# EAGLE schematic Control board (EAGLE 7.2.0)
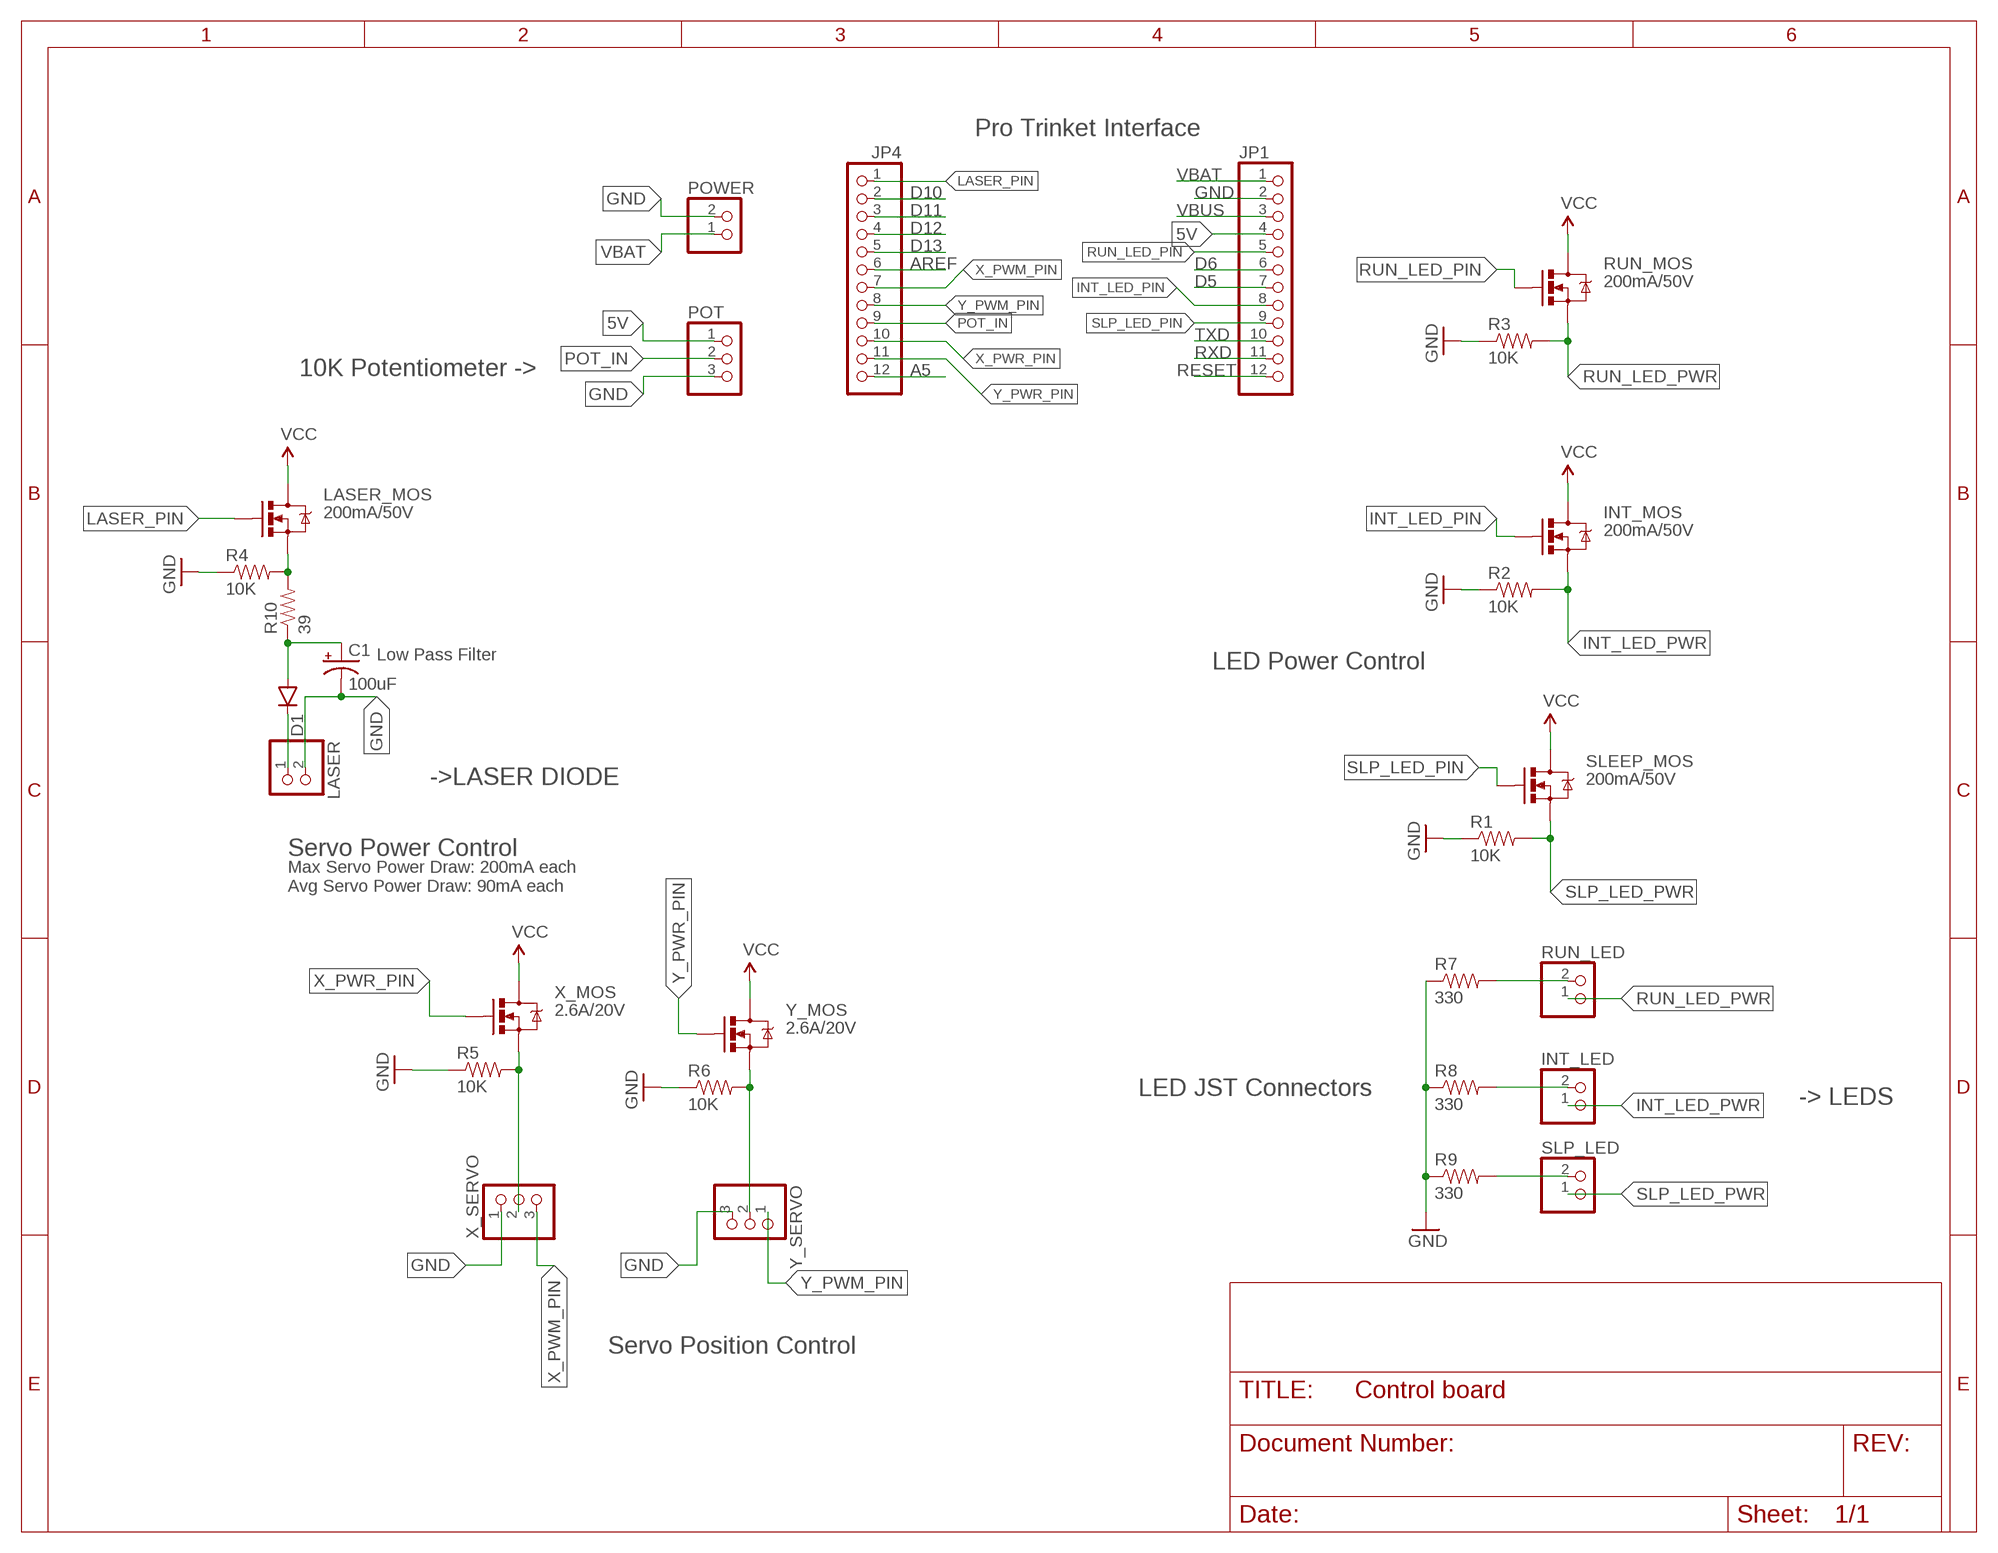
[diagram p0: schematic, sheet 1]

## Parts
C1  100uF  100UF-10V-10%(TANT)  [EIA7343]
D1  DIODESOD123  [SOD-123]
INT_LED  JST_2PIN-SMT-RA  [JST-PH-2-SMT-RA]
INT_MOS  200mA/50V  MOSFET-NCHANNELBSS138  [SOT23-3]
JP1  PINHD-1X12-CB  [1X12-CB]
JP4  PINHD-1X12-CB  [1X12-CB]
LASER  JST_2PIN-SMT-RA  [JST-PH-2-SMT-RA]
LASER_MOS  200mA/50V  MOSFET-NCHANNELBSS138  [SOT23-3]
POT  JST_3PIN  [JSTPH3]
POWER  JST_2PIN-SMT-RA  [JST-PH-2-SMT-RA]
R1  10K  10KOHM-1/10W-1%(0603)0603  [0603-RES]
R2  10K  10KOHM-1/10W-1%(0603)0603  [0603-RES]
R3  10K  10KOHM-1/10W-1%(0603)0603  [0603-RES]
R4  10K  10KOHM-1/10W-1%(0603)0603  [0603-RES]
R5  10K  10KOHM-1/10W-1%(0603)0603  [0603-RES]
R6  10K  10KOHM-1/10W-1%(0603)0603  [0603-RES]
R7  330  3.3MOHM-1/10W-1%(0603)  [0603-RES]
R8  330  3.3MOHM-1/10W-1%(0603)  [0603-RES]
R9  330  3.3MOHM-1/10W-1%(0603)  [0603-RES]
R10  39  10KOHM-1/10W-1%(0603)0603  [0603-RES]
RUN_LED  JST_2PIN-SMT-RA  [JST-PH-2-SMT-RA]
RUN_MOS  200mA/50V  MOSFET-NCHANNELBSS138  [SOT23-3]
SLEEP_MOS  200mA/50V  MOSFET-NCHANNELBSS138  [SOT23-3]
SLP_LED  JST_2PIN-SMT-RA  [JST-PH-2-SMT-RA]
X_MOS  2.6A/20V  MOSFET-NCHANNELBSS138  [SOT23-3]
X_SERVO  PINHD-1X3  [1X03]
Y_MOS  2.6A/20V  MOSFET-NCHANNELBSS138  [SOT23-3]
Y_SERVO  PINHD-1X3  [1X03]

## Nets
5V: JP1.4 POT.1
A5: JP4.12
AREF: JP4.6
D5: JP1.7
D6: JP1.6
D10: JP4.2
D11: JP4.3
D12: JP4.4
D13: JP4.5
GND [power]: C1.C(-) JP1.2 LASER.2 POT.3 POWER.2 R1.1 R2.1 R3.1 R4.1 R5.1 R6.1 R7.1 R8.1 R9.1 X_SERVO.1 Y_SERVO.3
INT_LED_PIN: INT_MOS.1(G) JP1.8
INT_LED_PWR: INT_LED.1 INT_MOS.2(S) R2.2
LASER_PIN: JP4.1 LASER_MOS.1(G)
LASER_PWR: LASER_MOS.2(S) R4.2 R10.2
N$1: C1.A(+) D1.A R10.1
N$2: D1.C LASER.1
N$6: R6.2 Y_MOS.2(S) Y_SERVO.2
N$7: R5.2 X_MOS.2(S) X_SERVO.2
N$8: R7.2 RUN_LED.2
N$9: INT_LED.2 R8.2
N$10: R9.2 SLP_LED.2
POT_IN: JP4.9 POT.2
RESET: JP1.12
RUN_LED_PIN: JP1.5 RUN_MOS.1(G)
RUN_LED_PWR: R3.2 RUN_LED.1 RUN_MOS.2(S)
RXD: JP1.11
SLP_LED_PIN: JP1.9 SLEEP_MOS.1(G)
SLP_LED_PWR: R1.2 SLEEP_MOS.2(S) SLP_LED.1
TXD: JP1.10
VBAT: INT_MOS.3(D) JP1.1 LASER_MOS.3(D) POWER.1 RUN_MOS.3(D) SLEEP_MOS.3(D) X_MOS.3(D) Y_MOS.3(D) ; supply symbol labelled VCC
VBUS [power]: JP1.3
X_PWM_PIN: JP4.7 X_SERVO.3
X_PWR_PIN: JP4.10 X_MOS.1(G)
Y_PWM_PIN: JP4.8 Y_SERVO.1
Y_PWR_PIN: JP4.11 Y_MOS.1(G)

## Notes on the sheet
- Pro Trinket Interface
- 10K Potentiometer ->
- Low Pass Filter | LED Power Control
- ->LASER DIODE
- Servo Power Control
- Max Servo Power Draw: 200mA each
  Avg Servo Power Draw: 90mA each
- LED JST Connectors
- -> LEDS
- Servo Position Control

## Library data of the parts
C1 = SparkFun-Capacitors:100UF-10V-10%(TANT): CAP-07890; PROD_ID: CAP-07890
D1 = SparkFun-DiscreteSemi:DIODE: Diode These are standard reverse protection diodes and small signal diodes. SMA package can handle up to about 1A. SOD-323 can handle about 200mA. What the SOD-323 package when ordering, there are some mfgs out there that are 5-pin packages.
INT_LED LASER POWER RUN_LED SLP_LED = adafruit:JST_2PIN: JST 2-Pin Connectors of various flavors SMT-RA (S2B-PH-SM4) 4UConnector #17311 SMT (B2B-PH-SM4) THM-RA (S2B-PH) THM (B2B-PH)
INT_MOS LASER_MOS RUN_MOS SLEEP_MOS = SparkFun-DiscreteSemi:MOSFET-NCHANNEL: Common NMOSFET Parts MFG P/N Store ID Prod ID FDD8780 TRANS-09984 SI7820DN TRANS-11055 FDS6630A IC-08089 2N7002PW TRANS-11151 FQP30N06L COM-10213 TRANS-10060 BSS123LT1G TRANS-08345 BSS138 TRANS-00830 BS170 2N7000; PROD_ID: TRANS-00830
JP1 JP4 = adafruit:PINHD-1X12: PIN HEADER
POT = adafruit:JST_3PIN
R1-R6 = SparkFun-Resistors:10KOHM-1/10W-1%(0603): RES-00824; PROD_ID: RES-00824
R7-R9 = SparkFun-Resistors:3.3MOHM-1/10W-1%(0603): RES-11057; PROD_ID: RES-11057
R10 = SparkFun-Resistors:10KOHM-1/10W-1%(0603): RES-00824; PROD_ID: RES-00824; VALUE: 10K
X_MOS Y_MOS = SparkFun-DiscreteSemi:MOSFET-NCHANNEL: Common NMOSFET Parts MFG P/N Store ID Prod ID FDD8780 TRANS-09984 SI7820DN TRANS-11055 FDS6630A IC-08089 2N7002PW TRANS-11151 FQP30N06L COM-10213 TRANS-10060 BSS123LT1G TRANS-08345 BSS138 TRANS-00830 BS170 2N7000; PROD_ID: TRANS-00830; VALUE: 200mA/50V
X_SERVO Y_SERVO = adafruit:PINHD-1X3: PIN HEADER

## Net classes
1 power: width 0.305 mm